# EAGLE schematic CircuitRiver - Breakout Spring (EAGLE 7.5.0)
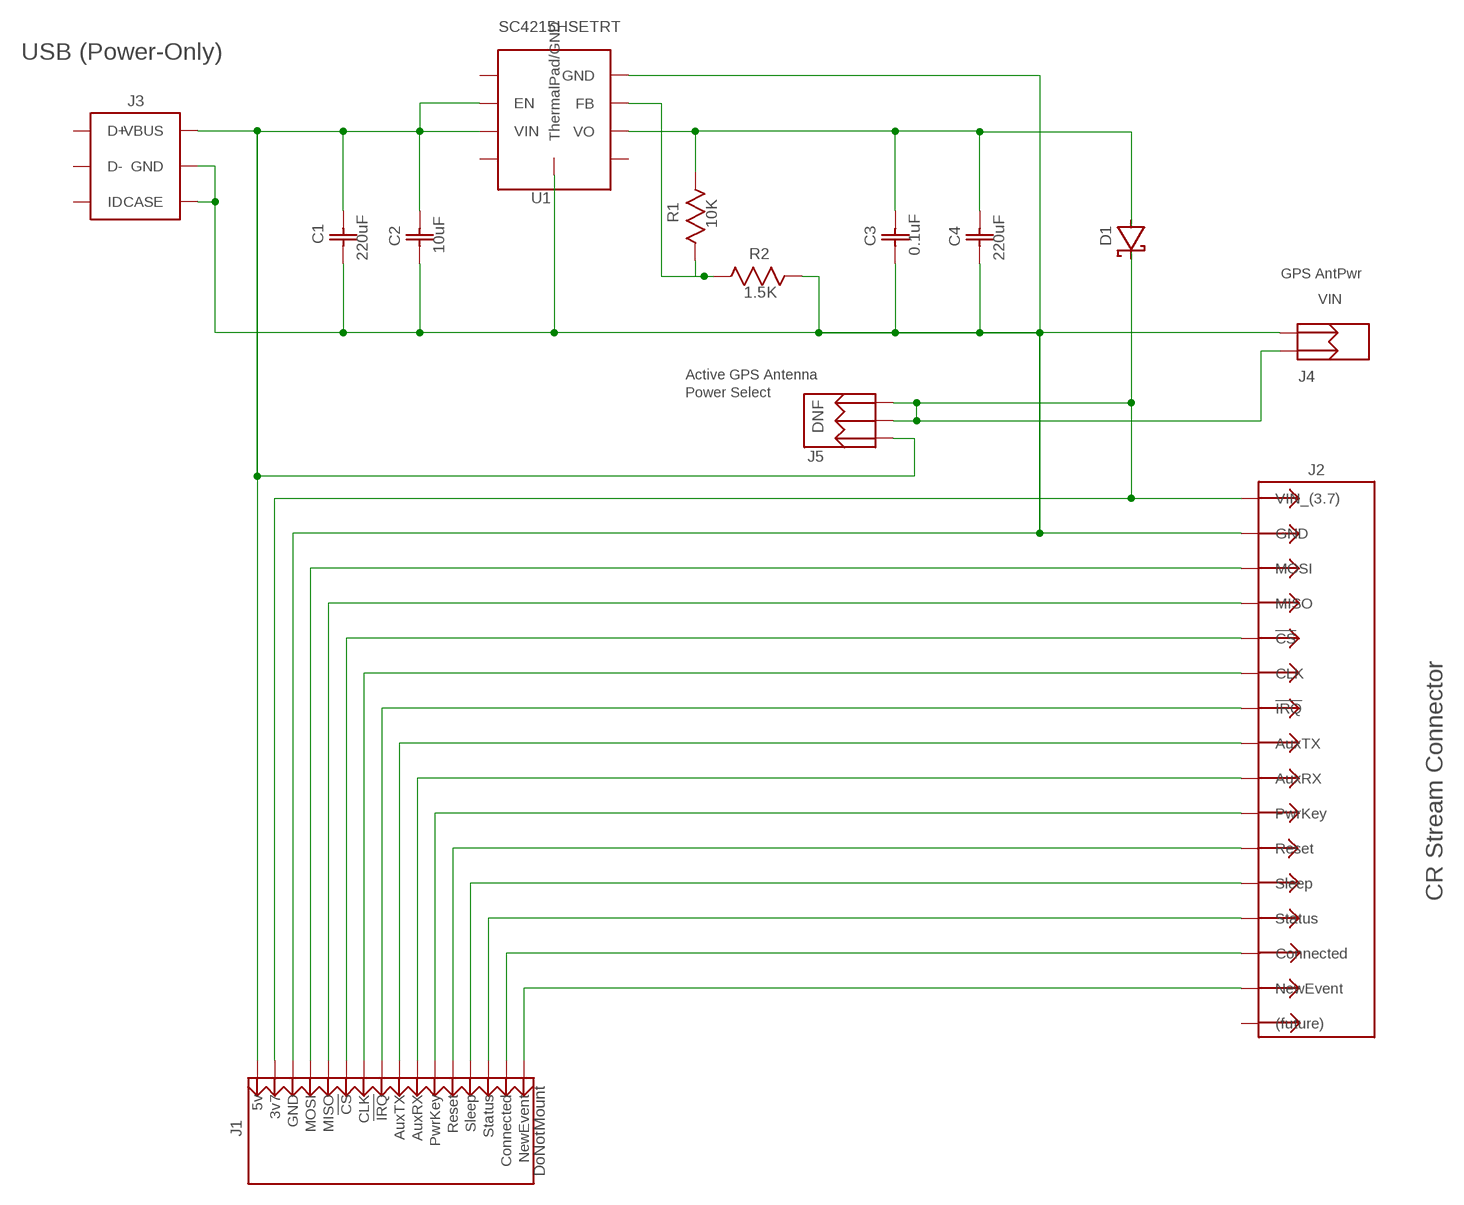
[diagram p0: schematic, sheet 1]

## Parts
C1  220uF  CAP_1206_NP  [CAP_1206]
C2  10uF  CAP_0603_NP  [CAP_0603]
C3  0.1uF  DEV_C3  [0603_NP]
C4  220uF  CAP_1206_NP  [CAP_1206]
D1  SCHOTTKY_RECT_-_2A60V  [SOD-123FL_Diode]
J1  DoNotMount  BREADBOARD-16  [HDR-1x16T/2.54]
J2  HA-CTA_HEADER  [HDR-2x8T/2x2/16x4]
J3  USB_JACK  [ZX62-B-5P]
J4  JST_PH-2_T/H  [JST_PH-2_T/H]
J5  DNF  3PIN_T/H_HEADER  [HDR-1x3T/2/6x2]
LG1  LOOUQ_LOGO  [LooUQ-6mm]
LG2  CIRCUITRIVER_LOGO  [CircuitRiver-6mm]
R1  10K  RES_0603  [RES_0603]
R2  1.5K  RES_0603  [RES_0603]
U1  SC4215HSETRT  SC4215H_LDO  [SOIC-8EP/150mil]

## Nets
Net_0: C1.1 C2.2 J1.1(5v) J3.1(VBUS) J5.3 U1.2(EN) U1.3(VIN)
Net_1: D1.1(C) J1.2(3v7) J2.2(VIN_(3.7)) J4.1 J5.1 J5.2
Net_2: R1.1 R2.2 U1.7(FB)
Net_3: J1.16(NewEvent) J2.16(NewEvent)
Net_4: J1.15(Connected) J2.13(Connected)
Net_5: J1.14(Status) J2.14(Status)
Net_6: J1.13(Sleep) J2.11(Sleep)
Net_7: J1.12(Reset) J2.12(Reset)
Net_8: J1.11(PwrKey) J2.9(PwrKey)
Net_9: J1.10(AuxRX) J2.10(AuxRX)
Net_10: J1.9(AuxTX) J2.7(AuxTX)
Net_11: J1.8(!IRQ) J2.8(!IRQ)
Net_12: J1.7(CLK) J2.5(CLK)
Net_13: J1.6(!CS) J2.6(!CS)
Net_14: J1.5(MISO) J2.3(MISO)
Net_15: J1.4(MOSI) J2.4(MOSI)
Net_GND: C1.2 C2.1 C3.1 C4.1 J1.3(GND) J2.1(GND) J3.5(GND) J3.6(CASE) J3.8(CASE) J4.2 R2.1 U1.8(GND) U1.9(ThermalPad/GND)
VBAT: C3.2 C4.2 D1.2(A) R1.2 U1.6(VO)
Unconnected: J2.15((future)) J3.2(D-) J3.3(D+) J3.4(ID) U1.1(NC) U1.4(NC) U1.5(NC)

## Notes on the sheet
- USB (Power-Only)
- GPS AntPwr
- VIN
- Active GPS Antenna
- Power Select
- CR Stream Connector

## Library data of the parts
C1 C4 = common:CAP_1206_NP; DATASHEET: https://search.murata.co.jp/Ceramy/image/img/A01X/G101/ENG/GRM31CR60J227ME11-01.pdf; MANUFACTURER: Murata; MFGPARTNM: GRM31CR60J227ME11L
C2 = common:CAP_0603_NP; MANUFACTURER: Samsung; MFGPARTNM: CL10A106MQ8NNNC
C3 = common:DEV_C3; MANUFACTURER: Samsung; MFGPARTNM: CL10B104KB8NNNC
D1 = common:SCHOTTKY_RECT_-_2A60V; DATASHEET: https://www.onsemi.com/pub/Collateral/NTS260ESF-D.PDF; DESCRIPTION: DIODE SCHOTTKY 60V 2A SOD123FL; MANUFACTURER: On Semiconductor; MFGPARTNM: NRVTS260ESFT1G
J1 = common:BREADBOARD-16
J2 = common:HA-CTA_HEADER; DATASHEET: https://cdn.harwin.com/pdfs/M22-204.pdf; MANUFACTURER: Harwin; MFGPARTNM: M22-2040805
J3 = common:USB_JACK; DATASHEET: http://datasheets.diptrace.com/con_usb/ZX62-B-5P.pdf; MANUFACTURER: Hirose; MFGPARTNM: ZX62-B-5PA(33)
J4 = common:JST_PH-2_T/H; DATASHEET: https://media.digikey.com/pdf/Data%20Sheets/3M%20PDFs/951yyy-xx22-AR_Series%20Datasheet.pdf; MANUFACTURER: JST; MFGPARTNM: 951102-8622-AR
J5 = common:3PIN_T/H_HEADER; DATASHEET: https://media.digikey.com/pdf/Data%20Sheets/3M%20PDFs/951yyy-xx22-AR_Series%20Datasheet.pdf; MANUFACTURER: 3M; MFGPARTNM: 951103-8622-AR
LG1 = common:LOOUQ_LOGO
LG2 = common:CIRCUITRIVER_LOGO
R1 = common:RES_0603; MANUFACTURER: Stackpole; MFGPARTNM: RNCP0603FTD10K0
R2 = common:RES_0603; MANUFACTURER: Stackpole; MFGPARTNM: RNCP0603FTD10K0; VALUE: 10K
U1 = common:SC4215H_LDO; DATASHEET: https://www.semtech.com/uploads/documents/sc4215a.pdf; DESCRIPTION: IC REG LINEAR POS ADJ 2A 8SOIC; MANUFACTURER: Semtech; MFGPARTNM: SC4215HSETRT